# Altium project DE-180417.PrjPcb
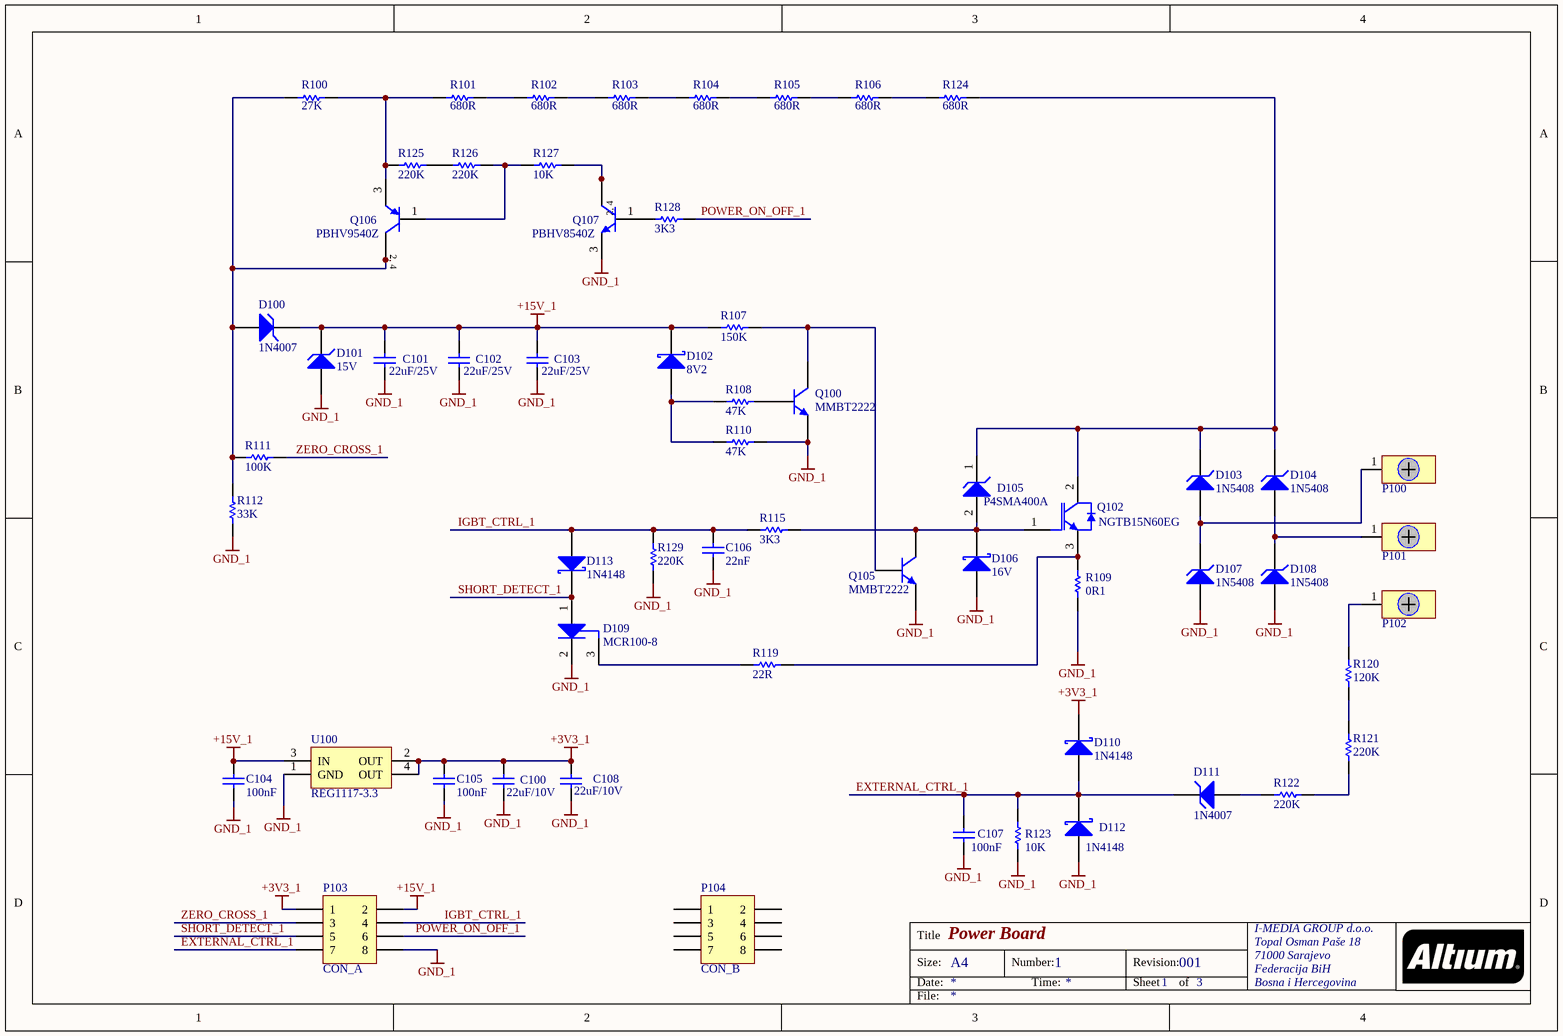
[diagram p0: DE-180417_01.SchDoc]
3 sheets, 113 parts. Net scope: global (net labels, ports and power ports of the same name join across sheets).
Board file: DE-180417.PcbDoc
Sheets:
  DE-180417_01.SchDoc
  DE-180417_02.SchDoc
  DE-180417_03.SchDoc

## Sheet DE-180417_01.SchDoc: Power Board
size A4; Author: eldar6776@hotmail.com; DrawnBy: Eldar Dedić; Organization: I-MEDIA GROUP d.o.o.; Address1: Topal Osman Paše 18; Address2: 71000 Sarajevo; Address3: Federacija BiH; Address4: Bosna i Hercegovina; DocumentNumber: 1; Revision: 001; SheetNumber: 1; SheetTotal: 3; ProjectName: Prekidač rasvjete balkona

### Parts
C100  22uF/10V  [1210]
C101  22uF/25V  [1210]
C102  22uF/25V  [1210]
C103  22uF/25V  [1210]
C104  100nF  [0603]
C105  100nF  [0603]
C106  22nF  [0603]
C107  100nF  [0603]
C108  22uF/10V  [1210]
D100  1N4007  [DO214]
D101  15V  [DO214]
D102  8V2  [SOD323]
D103  1N5408  [DO214]
D104  1N5408  [DO214]
D105  P4SMA400A  [ONSC-SMC-2-403-03_V]
D106  16V  [SOD323]
D107  1N5408  [DO214]
D108  1N5408  [DO214]
D109  MCR100-8  [INF-SOT89_N]
D110  1N4148  [SOD323]
D111  1N4007  [DO214]
D112  1N4148  [SOD323]
D113  1N4148  [SOD323]
P100  Single Wire Lug  [Single Wire Lug]  (value not drawn)
P101  Single Wire Lug  [Single Wire Lug]  (value not drawn)
P102  Single Wire Lug  [Single Wire Lug]  (value not drawn)
P103  CON_A  [HDR2X4]
P104  CON_B  [HDR2X4]
Q100  MMBT2222  [SOT23_N]
Q102  NGTB15N60EG  [ONSC-TO-220-3-221A-09]
Q105  MMBT2222  [SOT23_N]
Q106  PBHV9540Z  [SOT223_N]
Q107  PBHV8540Z  [SOT223_N]
R100  27K  [12-1812]
R101  680R  [12-1812]
R102  680R  [12-1812]
R103  680R  [12-1812]
R104  680R  [12-1812]
R105  680R  [12-1812]
R106  680R  [12-1812]
R107  150K  [ERA-0603]
R108  47K  [ERA-0603]
R109  0R1  [14-1210]
R110  47K  [ERA-0603]
R111  100K  [ERA-0603]
R112  33K  [ERA-0805]
R115  3K3  [ERA-0603]
R119  22R  [ERA-0603]
R120  120K  [ERA-0805]
R121  220K  [ERA-0805]
R122  220K  [ERA-0805]
R123  10K  [ERA-0603]
R124  680R  [12-1812]
R125  220K  [ERA-0805]
R126  220K  [ERA-0805]
R127  10K  [ERA-0805]
R128  3K3  [ERA-0805]
R129  220K  [ERA-0603]
U100  REG1117-3.3  [ZZ311]

### Nets
+3V3_1: C100.2 C105.2 C108.2 D110.1(K) P103.1 U100.2(OUT) U100.4(OUT)
+15V_1: C101.2 C102.2 C103.2 C104.2 D100.2(K) D101.2(K) D102.1(K) P103.2 R107.1 U100.3(IN)
GND_1: C100.1 C101.1 C102.1 C103.1 C104.1 C105.1 C106.1 C107.1 C108.1 D101.1(A) D106.2(A) D107.1(A) D108.1(A) D109.2(K) D112.2(A) P103.8 Q100.2(E) Q105.2(E) Q107.3(E) R109.1 R110.2 R112.1 R123.1 R129.1 U100.1(GND)
EXTERNAL_CTRL_1: C107.2 D110.2(A) D111.2(K) D112.1(K) P103.7 R123.2
IGBT_CTRL_1: C106.2 D113.2(A) P103.4 R115.1 R129.2
POWER_ON_OFF_1: P103.6 R128.1
SHORT_DETECT_1: D109.1(A) D113.1(K) P103.5
ZERO_CROSS_1: P103.3 R111.1
NetD100_1: D100.1(A) Q106.2(C) Q106.4(C) R100.1 R111.2 R112.2
NetD102_2: D102.2(A) R108.1 R110.1
NetD103_1: D103.1(A) D107.2(K) P100.1
NetD103_2: D103.2(K) D104.2(K) D105.1(K) Q102.2(C) R124.2
NetD104_1: D104.1(A) D108.2(K) P101.1
NetD105_2: D105.2(A) D106.1(K) Q102.1(G) Q105.3(C) R115.2
NetD109_3: D109.3(G) R119.1
NetD111_1: D111.1(A) R122.2
NetP102_1: P102.1 R120.1
NetQ100_1: Q100.1(B) R108.2
NetQ100_3: Q100.3(C) Q105.1(B) R107.2
NetQ102_3: Q102.3(E) R109.2 R119.2
NetQ106_1: Q106.1(B) R126.1 R127.2
NetQ106_3: Q106.3(E) R100.2 R101.1 R125.1
NetQ107_1: Q107.1(B) R128.2
NetQ107_2: Q107.2(C) Q107.4(C) R127.1
NetR101_2: R101.2 R102.1
NetR102_2: R102.2 R103.1
NetR103_2: R103.2 R104.1
NetR104_2: R104.2 R105.1
NetR105_2: R105.2 R106.1
NetR106_2: R106.2 R124.1
NetR120_2: R120.2 R121.1
NetR121_2: R121.2 R122.1
NetR125_2: R125.2 R126.2

Not connected (* = marked no-connect by the designer): P104 1 2 3 4 5 6 7 8

### Notes on the sheet
- Title
- Size:
- Date:
- A4
- Number:
- Time:
- Revision:
- Sheet
- of
- File:
- (in symbol BCP51) 2, 4
- (in symbol BCP54) 2, 4

### Library data of the parts
C100-C103 C108 = C1210: Ceramic Chip Capacitor - Standard; Published: 17-Jul-2002; LatestRevisionDate: 19-Mar-2004; LatestRevisionNote: Silkscreen size reduced.; DatasheetDocument: Mar-2001; PackageDocument: Mar-2001; PackageReference: 1210; Publisher: Altium Limited; Code_JEITA: 1210; Code_IPC: 3225 [1210]; ComponentLink1Description: Manufacturer Link; ComponentLink1URL: http://www.kemet.com/; ComponentLink2Description: Datasheet; ComponentLink2URL: http://www.kemet.com/kemet/web/homepage/kechome.nsf/vapubfilesname/F3102TA.pdf/$file/F3102TA.pdf
  C100 C108: Value: 22uF/10V
  C101-C103: Value: 22uF/25V
C104-C107 = C0603: Ceramic Chip Capacitor - Standard; Note: Footprint corresponds to dimensions for bulk cassette packaging. This case size has tightened tolerances.; Published: 17-Jul-2002; LatestRevisionDate: 19-Mar-2004; LatestRevisionNote: Silkscreen size reduced.; DatasheetDocument: Mar-2001; PackageDocument: Mar-2001; PackageReference: 0603; Publisher: Altium Limited; Code_JEITA: 0603; Code_IPC: 1608 [0603]; ComponentLink1Description: Manufacturer Link; ComponentLink1URL: http://www.kemet.com/; ComponentLink2Description: Datasheet; ComponentLink2URL: http://www.kemet.com/kemet/web/homepage/kechome.nsf/vapubfilesname/F3102TA.pdf/$file/F3102TA.pdf
D100 D111 = BZG03C10: Silicon Zener Diode (3W); Published: 8-Jun-2000; LatestRevisionDate: 17-Jul-2002; LatestRevisionNote: Re-released for DXP Platform.; DatasheetDocument: 1-Apr-1999; PackageDocument: Apr-1999; PackageReference: DO214; Publisher: Altium Limited; ComponentLink1Description: Manufacturer Link; ComponentLink1URL: http://www.vishay.com/; ComponentLink2Description: Datasheet; ComponentLink2URL: http://www.vishay.com/docs/85593/85593.pdf
D101 D103 D104 D107 D108 = BZG05C15: Silicon Zener Diode (3W); Published: 8-Jun-2000; LatestRevisionDate: 17-Jul-2002; LatestRevisionNote: Re-released for DXP Platform.; DatasheetDocument: 1-Apr-1999; PackageDocument: Apr-1999; PackageReference: DO214; Publisher: Altium Limited; ComponentLink1Description: Manufacturer Link; ComponentLink1URL: http://www.vishay.com/; ComponentLink2Description: Datasheet; ComponentLink2URL: http://www.vishay.com/docs/85595/85595.pdf
  D101: Value: 15V
  D103 D104 D107 D108: Value: 1N5408
D102 D106 D110 D112 D113 = 1PS76SB10: Schottky Barrier Diode; Published: 17-Sep-2003; LatestRevisionDate: 19-Mar-2004; LatestRevisionNote: Silkscreen size reduced.; DatasheetVersion: 14-Oct-1996; PackageVersion: May-1999; PackageReference: SOD323; Publisher: Altium Limited; PackageDescription: SOD-323/SC-76; 2 Leads; Body 1.7 x 1.3 mm, (LxW); ComponentLink1Description: Manufacturer Link; ComponentLink1URL: http://www.semiconductors.philips.com/; ComponentLink2Description: Datasheet; ComponentLink2URL: http://www.semiconductors.philips.com/acrobat/datasheets/1PS76SB10_2.pdf
D105 = 1SMC9.0AT3G: 1500 W Peak Power Zener Transient Voltage Suppressor, Unidirectional, 2-Pin SMC, Pb-Free, Tape and Reel; Manufacturer: On Semiconductor; IR Max (uA): 10; PPK Max (W): 1500; V(BR) Typ (V): 10.55; DatasheetVersion: Rev. 8; PackageVersion: Rev. E, 08/2005; PackageReference: SMC-2-403-03; PackageDescription: 2-Pin Small Molded Package, J-Bend Lead, Body 5.845 x 6.855 mm; Supplier 1: Digi-Key; Supplier Part Number 1: 1SMC9.0AT3G-ND; Supplier 2: Mouser; Supplier Part Number 2: 863-1SMC9.0AT3G; Direction: Unidirectional; Packing: Tape and Reel; RoHS: Pb-Free; Mounting Technology: Surface Mount; PartNumber: 1SMC9.0AT3G; ComponentLink1Description: Manufacturer URL; ComponentLink1URL: http://www.onsemi.com/; ComponentLink2Description: Datasheet; ComponentLink2URL: http://www.onsemi.com/pub_link/Collateral/1SMC5.0AT3-D.PDF; ComponentLink3Description: Package Specification; ComponentLink3URL: http://www.onsemi.com/pub_link/Collateral/403-03.PDF
D109 = BAW78D: Silicon Switching Diode, SOT89, Reel, Green; Manufacturer: Infineon; Green: TRUE; PackageReference: SOT89; PackageDescription: 3-Pin Small Outline Transistor Package, 2.5 x 4.5 mm Body; Supplier 1: Mouser; Supplier Part Number 1: N/A; Packing: Reel; Mounting Technology: Surface Mount; PartNumber: BAW78D; ComponentLink1Description: Manufacturer URL; ComponentLink1URL: http://www.infineon.com/; ComponentLink2Description: Datasheet; ComponentLink2URL: http://www.infineon.com/dgdl/baw78_baw79series.pdf?folderId=db3a30431400ef6801141c4ed9df0449&fileId=db3a30431400ef6801141c5037ac044a; ComponentLink3Description: Package Specification; ComponentLink3URL: http://www.infineon.com/dgdl/SOT89-Package_Overview.pdf?folderId=db3a30431936bc4b01195371b8363cff&fileId=db3a30431936bc4b0119537ed61d3d22
P100-P102 = Wire Lug
P103 P104 = Header 4X2: Header, 4-Pin, Dual row; LatestRevisionDate: 17-Jul-2002; LatestRevisionNote: Re-released for DXP Platform.; Publisher: Altium Limited
Q100 Q105 = BC817: NPN General-purpose Transistor; Published: 17-Sep-2003; LatestRevisionDate: 12-Dec-2006; LatestRevisionNote: IPC-7351 Footprint Added.; DatasheetVersion: Jun-1999; PackageVersion: May-1999; PackageReference: SOT23; Publisher: Altium Limited; PackageDescription: 3-Pin SOT-23 Package 0.95 mm Pitch, 2.3 mm Lead Span; ComponentLink1Description: Manufacturer Link; ComponentLink1URL: http://www.semiconductors.philips.com/; ComponentLink2Description: Datasheet; ComponentLink2URL: http://www.semiconductors.philips.com/acrobat/datasheets/BC817_BC817W_BC337_5.pdf
Q102 = NGTB15N60EG: IGBT - Short-Circuit Rated, 3-Pin TO-220, Pb-Free, Tube; Manufacturer: On Semiconductor; DatasheetVersion: Rev. 7; PackageVersion: Rev. AG, 09/2011; PackageReference: TO-220-3-221A-09; PackageDescription: 3-Pin Flange Mount, Vertical Straight Lead, Body 9.97 x 4.445 mm, Pitch 2.54 mm; Supplier 1: Digi-Key; Supplier Part Number 1: NGTB15N60EGOS-ND; Supplier 2: Farnell; Supplier Part Number 2: 2216666; Supplier 3: Newark; Supplier Part Number 3: 07W7304; Supplier 4: Newark; Supplier Part Number 4: 46W5231; Supplier 5: Mouser; Supplier Part Number 5: 863-NGTB15N60EG; Packing: Tube; RoHS: Pb-Free; Mounting Technology: Through Hole; PartNumber: NGTB15N60EG; ComponentLink1Description: Manufacturer URL; ComponentLink1URL: http://www.onsemi.com/; ComponentLink2Description: Datasheet; ComponentLink2URL: http://www.onsemi.com/pub_link/Collateral/NGTB15N60E-D.PDF; ComponentLink3Description: Package Specification; ComponentLink3URL: http://www.onsemi.com/pub_link/Collateral/221A-09.PDF
Q106 = BCP51: PNP Medium Power Transistor; Published: 17-Sep-2003; LatestRevisionDate: 12-Dec-2006; LatestRevisionNote: IPC-7351 Footprint Added.; DatasheetVersion: 10-Oct-2001; PackageVersion: Aug-2001; PackageReference: SOT223; Publisher: Altium Limited; PackageDescription: 4-Pin SOT-223 Package 2.3 mm Pitch, 7 mm Lead Span; ComponentLink1Description: Manufacturer Link; ComponentLink1URL: http://www.semiconductors.philips.com/; ComponentLink2Description: Datasheet; ComponentLink2URL: http://www.semiconductors.philips.com/acrobat/datasheets/BCP51_52_53_5.pdf
Q107 = BCP54: NPN Medium Power Transistor; Published: 17-Sep-2003; LatestRevisionDate: 12-Dec-2006; LatestRevisionNote: IPC-7351 Footprint Added.; DatasheetVersion: 10-Oct-2001; PackageVersion: Aug-2001; PackageReference: SOT223; Publisher: Altium Limited; PackageDescription: 4-Pin SOT-223 Package 2.3 mm Pitch, 7 mm Lead Span; ComponentLink1Description: Manufacturer Link; ComponentLink1URL: http://www.semiconductors.philips.com/; ComponentLink2Description: Datasheet; ComponentLink2URL: http://www.semiconductors.philips.com/acrobat/datasheets/BC635_BCP54_BCX54_6.pdf
R100-R106 R124 = ERJ12: Thick Film Chip Resistor, 1 Ohm to 10M Ohm Range, 5% Tolerance, 1812 Size, 0.5 W; Note: If flow soldering, adjust pad width of PCB Footprint to 0.7 - 0.8 times the width of the resistor.; Published: 17-Dec-2003; LatestRevisionDate: 19-Mar-2004; LatestRevisionNote: Silkscreen size reduced.; PackageDocument: Mar-2003; PackageReference: 12-1812; Publisher: Altium Limited; ComponentLink1Description: Manufacturer Link; ComponentLink1URL: http://www.panasonic.com/industrial/components/resistive_products.htm; ComponentLink2Description: Datasheet; ComponentLink2URL: http://www.panasonic.com/industrial/components/pdf/AOA0000CE1.pdf
  R100: Value: 27K
  R101-R106 R124: Value: 680R
R107 R108 R110 R111 R115 R119 R123 R129 = ERAV: Metal Film Thermosensitive Chip Resistor, 0.56 Ohm to 10k Ohm Range, 5% Tolerance, 0603 Size, 0.063 W; Note: If flow soldering, adjust pad width of PCB Footprint to 0.7 - 0.8 times the width of the resistor.; Published: 17-Dec-2003; LatestRevisionDate: 19-Mar-2004; LatestRevisionNote: Silkscreen size reduced.; PackageDocument: Mar-2003; PackageReference: ERA-0603; Publisher: Altium Limited; Code_IPC: 1608 [0603]; ComponentLink1Description: Manufacturer Link; ComponentLink1URL: http://www.panasonic.com/industrial/components/resistive_products.htm; ComponentLink2Description: Datasheet; ComponentLink2URL: http://www.panasonic.com/industrial/components/pdf/AOF0000CE1.pdf
R109 = ERJ14: Thick Film Chip Resistor, 1 Ohm to 10M Ohm Range, 5% Tolerance, 1210 Size, 0.25 W; Note: If flow soldering, adjust pad width of PCB Footprint to 0.7 - 0.8 times the width of the resistor.; Published: 17-Dec-2003; LatestRevisionDate: 19-Mar-2004; LatestRevisionNote: Silkscreen size reduced.; PackageDocument: Mar-2003; PackageReference: 14-1210; Publisher: Altium Limited; Code_IPC: 3225 [1210]; ComponentLink1Description: Manufacturer Link; ComponentLink1URL: http://www.panasonic.com/industrial/components/resistive_products.htm; ComponentLink2Description: Datasheet; ComponentLink2URL: http://www.panasonic.com/industrial/components/pdf/AOA0000CE1.pdf; Value: 0R1
R112 R120-R122 R125-R128 = ERA6Y: Rectangular Thick Film Chip Resistor, 10 Ohm to 1M Ohm Range, 0.1% and 0.5% Tolerance, 0805 Size, 0.1 W; Note: If flow soldering, adjust pad width of PCB Footprint to 0.7 - 0.8 times the width of the resistor.; Published: 17-Dec-2003; LatestRevisionDate: 19-Mar-2004; LatestRevisionNote: Silkscreen size reduced.; PackageDocument: Mar-2003; PackageReference: ERA-0805; Publisher: Altium Limited; Code_IPC: 2012 [0805]; ComponentLink1Description: Manufacturer Link; ComponentLink1URL: http://www.panasonic.com/industrial/components/resistive_products.htm; ComponentLink2Description: Datasheet; ComponentLink2URL: http://www.panasonic.com/industrial/components/pdf/AOA0000CE8.pdf
  R112: Value: 33K
  R120: Value: 120K
  R121 R122: Value: 220K
U100 = REG1117-3.3: 800mA and 1A Low Dropout Positive Regulator 2.85V, 3.3V, 5V, and Adjustable; Published: 8-Jun-2000; LatestRevisionDate: 17-Jul-2002; LatestRevisionNote: Re-released for DXP Platform.; DatasheetVersion: Sep-1997; PackageVersion: revC; PackageReference: ZZ311; Publisher: Altium Limited; PackageDescription: SOT-223/SC-73; 4 Leads; Body 6.7 x 7.3 mm, inc. leads (LxW max); ComponentLink1Description: Manufacturer Link; ComponentLink1URL: http://www.ti.com/; ComponentLink2Description: Datasheet; ComponentLink2URL: http://www-s.ti.com/sc/ds/REG1117.pdf

## Sheet DE-180417_02.SchDoc: Microcontroller & Com Board
size A4; Author: eldar6776@hotmail.com; DrawnBy: Eldar Dedić; Organization: I-MEDIA GROUP d.o.o.; Address1: Topal Osman Paše 18; Address2: 71000 Sarajevo; Address3: Federacija BiH; Address4: Bosna i Hercegovina; DocumentNumber: 2; Revision: 001; SheetNumber: 2; SheetTotal: 3; ProjectName: Prekidač Balkonske Rasvjete
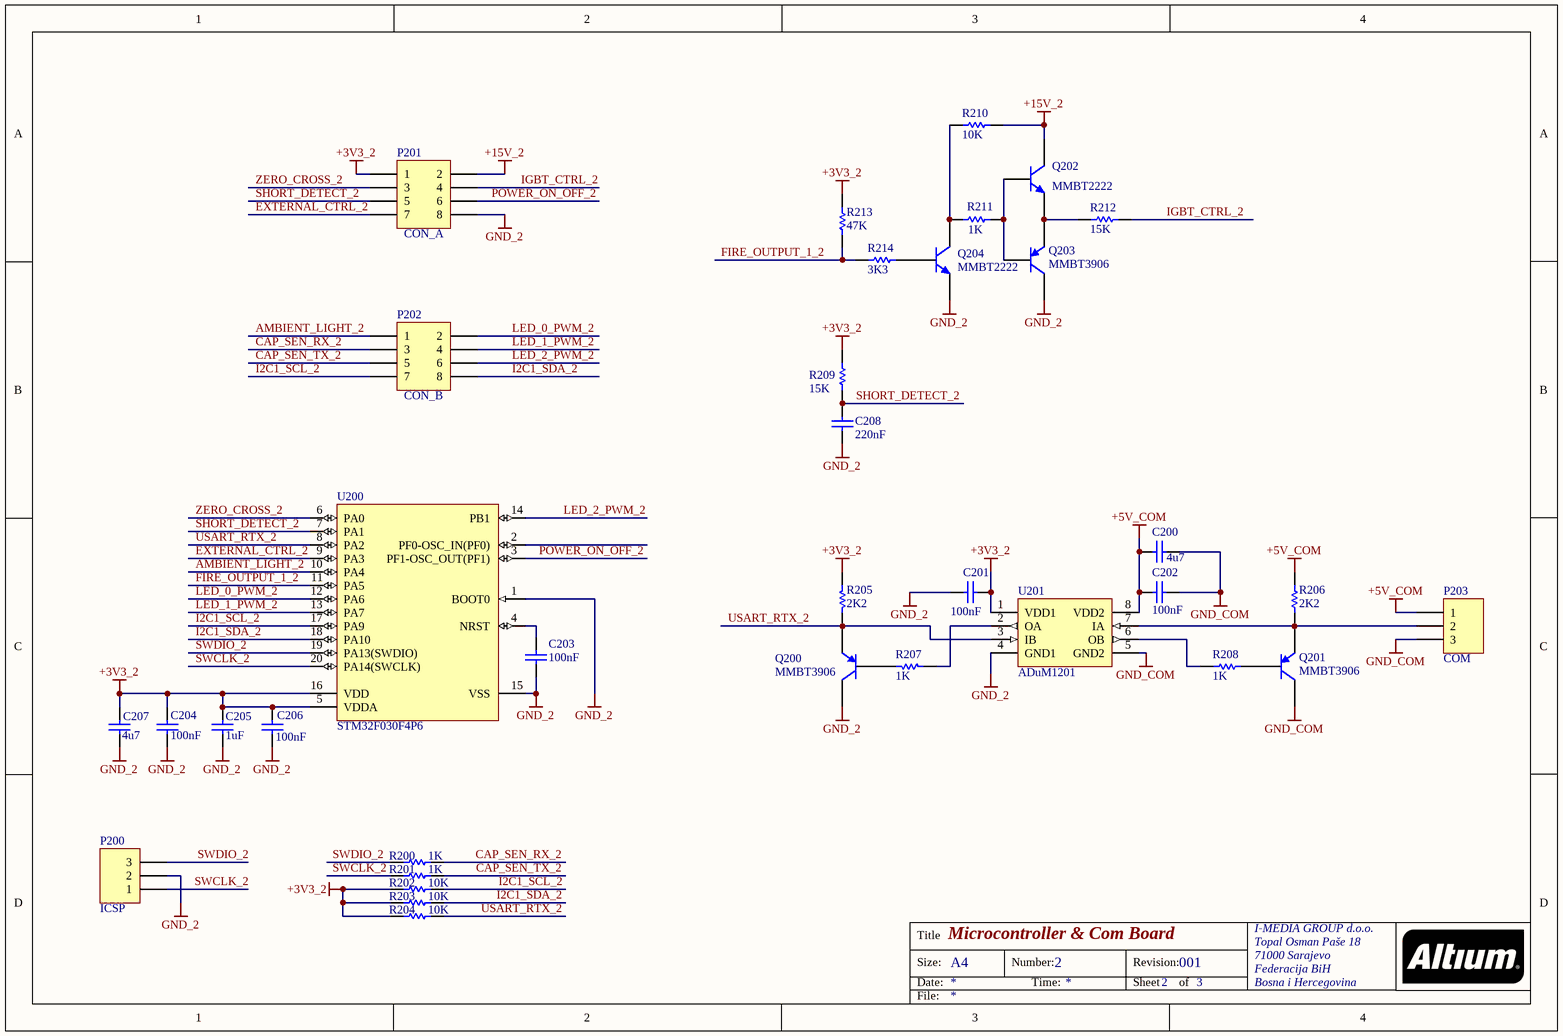
[diagram p1: DE-180417_02.SchDoc]

### Parts
C200  4u7  [0805]
C201  100nF  [0603]
C202  100nF  [0603]
C203  100nF  [0603]
C204  100nF  [0603]
C205  1uF  [0603]
C206  100nF  [0603]
C207  4u7  [0805]
C208  220nF  [0603]
P200  ICSP  [HDR1X3]
P201  CON_A  [HDR2X4]
P202  CON_B  [HDR2X4]
P203  COM  [HDR1X3]
Q200  MMBT3906  [SOT23_N]
Q201  MMBT3906  [SOT23_N]
Q202  MMBT2222  [SOT23_N]
Q203  MMBT3906  [SOT23_N]
Q204  MMBT2222  [SOT23_N]
R200  1K  [ERA-0603]
R201  1K  [ERA-0603]
R202  10K  [ERA-0603]
R203  10K  [ERA-0603]
R204  10K  [ERA-0603]
R205  2K2  [ERA-0603]
R206  2K2  [ERA-0603]
R207  1K  [ERA-0603]
R208  1K  [ERA-0603]
R209  15K  [ERA-0603]
R210  10K  [ERA-0603]
R211  1K  [ERA-0603]
R212  15K  [ERA-0603]
R213  47K  [ERA-0603]
R214  3K3  [ERA-0603]
U200  STM32F030F4P6  [STM-TSSOP20_N]
U201  ADuM1201  [SOP8]

### Nets
+3V3_2: C201.1 C204.1 C205.1 C206.1 C207.1 P201.1 R202.2 R203.2 R204.2 R205.1 R209.2 R213.1 U200.5(VDDA) U200.16(VDD) U201.1(VDD1)
+5V_COM: C200.1 C202.1 P203.1 R206.1 U201.8(VDD2)
+15V_2: P201.2 Q202.3(C) R210.1
GND_2: C201.2 C203.2 C204.2 C205.2 C206.2 C207.2 C208.1 P200.2 P201.8 Q200.3(C) Q203.3(C) Q204.2(E) U200.1(BOOT0) U200.15(VSS) U201.4(GND1)
GND_COM: C200.2 C202.2 P203.3 Q201.3(C) U201.5(GND2)
AMBIENT_LIGHT_2: P202.1 U200.10(PA4)
CAP_SEN_RX_2: P202.3 R200.1
CAP_SEN_TX_2: P202.5 R201.1
EXTERNAL_CTRL_2: P201.7 U200.9(PA3)
FIRE_OUTPUT_1_2: R213.2 R214.2 U200.11(PA5)
I2C1_SCL_2: P202.7 R202.1 U200.17(PA9)
I2C1_SDA_2: P202.8 R203.1 U200.18(PA10)
IGBT_CTRL_2: P201.4 R212.2
LED_0_PWM_2: P202.2 U200.12(PA6)
LED_1_PWM_2: P202.4 U200.13(PA7)
LED_2_PWM_2: P202.6 U200.14(PB1)
POWER_ON_OFF_2: P201.6 U200.3(PF1-OSC_OUT(PF1))
SHORT_DETECT_2: C208.2 P201.5 R209.1 U200.7(PA1)
SWCLK_2: P200.1 R201.2 U200.20(PA14(SWCLK))
SWDIO_2: P200.3 R200.2 U200.19(PA13(SWDIO))
USART_RTX_2: Q200.2(E) R204.1 R205.2 U200.8(PA2) U201.3(IB)
ZERO_CROSS_2: P201.3 U200.6(PA0)
NetC203_1: C203.1 U200.4(NRST)
NetP203_2: P203.2 Q201.2(E) R206.2 U201.7(IA)
NetQ200_1: Q200.1(B) R207.1
NetQ201_1: Q201.1(B) R208.1
NetQ202_1: Q202.1(B) Q203.1(B) R211.1
NetQ202_2: Q202.2(E) Q203.2(E) R212.1
NetQ204_1: Q204.1(B) R214.1
NetQ204_3: Q204.3(C) R210.2 R211.2
NetR207_2: R207.2 U201.2(OA)
NetR208_2: R208.2 U201.6(OB)

Not connected (* = marked no-connect by the designer): U200 2(PF0-OSC_IN(PF0))

### Notes on the sheet
- Title
- Size:
- Date:
- A4
- Number:
- Time:
- Revision:
- Sheet
- of
- File:

### Library data of the parts
C200 C207 = C0805: Ceramic Chip Capacitor - Standard; Note: Footprint corresponds to dimensions for bulk cassette packaging. This case size has tightened tolerances.; Published: 17-Jul-2002; LatestRevisionDate: 19-Mar-2004; LatestRevisionNote: Silkscreen size reduced.; DatasheetDocument: Mar-2001; PackageDocument: Mar-2001; PackageReference: 0805; Publisher: Altium Limited; Code_JEITA: 0805; Code_IPC: 2012[0805]; ComponentLink1Description: Manufacturer Link; ComponentLink1URL: http://www.kemet.com/; ComponentLink2Description: Datasheet; ComponentLink2URL: http://www.kemet.com/kemet/web/homepage/kechome.nsf/vapubfilesname/F3102TA.pdf/$file/F3102TA.pdf; Value: 4u7
C201-C205 C208 = C0603: as C104 on sheet DE-180417_01; Published: 17-Jul-2002; LatestRevisionDate: 19-Mar-2004; LatestRevisionNote: Silkscreen size reduced.; DatasheetDocument: Mar-2001; PackageDocument: Mar-2001; PackageReference: 0603; Publisher: Altium Limited; Code_JEITA: 0603; Code_IPC: 1608 [0603]; ComponentLink1Description: Manufacturer Link; ComponentLink1URL: http://www.kemet.com/; ComponentLink2Description: Datasheet; ComponentLink2URL: http://www.kemet.com/kemet/web/homepage/kechome.nsf/vapubfilesname/F3102TA.pdf/$file/F3102TA.pdf
  C203 C204: Value: 100nF
  C205: Value: 1uF
C206 = C0603: Ceramic Chip Capacitor - Standard; Note: Footprint corresponds to dimensions for bulk cassette packaging. This case size has tightened tolerances.; Value: 10nF; Published: 17-Jul-2002; LatestRevisionDate: 19-Mar-2004; LatestRevisionNote: Silkscreen size reduced.; DatasheetDocument: Mar-2001; PackageDocument: Mar-2001; PackageReference: 0603; Publisher: Altium Limited; Code_JEITA: 0603; Code_IPC: 1608 [0603]; ComponentLink1Description: Manufacturer Link; ComponentLink1URL: http://www.kemet.com/; ComponentLink2Description: Datasheet; ComponentLink2URL: http://www.kemet.com/kemet/web/homepage/kechome.nsf/vapubfilesname/F3102TA.pdf/$file/F3102TA.pdf
P200 P203 = Header 3: Header, 3-Pin; LatestRevisionDate: 17-Jul-2002; LatestRevisionNote: Re-released for DXP Platform.; Publisher: Altium Limited
P201 P202 = Header 4X2: Header, 4-Pin, Dual row; LatestRevisionDate: 17-Jul-2002; LatestRevisionNote: Re-released for DXP Platform.; Publisher: Altium Limited
Q200 Q201 Q203 = BC807: PNP General-purpose Transistor; Published: 17-Sep-2003; LatestRevisionDate: 12-Dec-2006; LatestRevisionNote: IPC-7351 Footprint Added.; DatasheetVersion: 8-Apr-1999; PackageVersion: May-1999; PackageReference: SOT23; Publisher: Altium Limited; PackageDescription: 3-Pin SOT-23 Package 0.95 mm Pitch, 2.3 mm Lead Span; ComponentLink1Description: Manufacturer Link; ComponentLink1URL: http://www.semiconductors.philips.com/; ComponentLink2Description: Datasheet; ComponentLink2URL: http://www.semiconductors.philips.com/acrobat/datasheets/BC807_BC807W_BC327_5.pdf
Q202 Q204 = BC817: NPN General-purpose Transistor; Published: 17-Sep-2003; LatestRevisionDate: 12-Dec-2006; LatestRevisionNote: IPC-7351 Footprint Added.; DatasheetVersion: Jun-1999; PackageVersion: May-1999; PackageReference: SOT23; Publisher: Altium Limited; PackageDescription: 3-Pin SOT-23 Package 0.95 mm Pitch, 2.3 mm Lead Span; ComponentLink1Description: Manufacturer Link; ComponentLink1URL: http://www.semiconductors.philips.com/; ComponentLink2Description: Datasheet; ComponentLink2URL: http://www.semiconductors.philips.com/acrobat/datasheets/BC817_BC817W_BC337_5.pdf
R200-R214 = ERAV: as R107 on sheet DE-180417_01; Published: 17-Dec-2003; LatestRevisionDate: 19-Mar-2004; LatestRevisionNote: Silkscreen size reduced.; PackageDocument: Mar-2003; PackageReference: ERA-0603; Publisher: Altium Limited; Code_IPC: 1608 [0603]; ComponentLink1Description: Manufacturer Link; ComponentLink1URL: http://www.panasonic.com/industrial/components/resistive_products.htm; ComponentLink2Description: Datasheet; ComponentLink2URL: http://www.panasonic.com/industrial/components/pdf/AOF0000CE1.pdf
U200 = STM32F030F4P6: ARM Cortex-M0 32-bit MCU, 16 KB Flash, 4 KB Internal RAM, 15 I/Os, 20-pin TSSOP, -40 to 85 degC, Tube; FLASH Size (Prog) (kB): 16; I/Os (High Current): 15; Internal RAM Size (kB): 4; Operating Frequency(F) (Processor speed) (MHz): 48; Supply Voltage(Vcc) min (V): 2.4; DatasheetVersion: Rev. 1; PackageVersion: Rev. 1, 11/2012; PackageReference: TSSOP20; PackageDescription: 20-Pin Thin Shrink Small Outline Package, 6.5 x 4.4 mm Body, 0.65 mm Pitch; Supplier 1: Digi-Key; Supplier Part Number 1: 497-14044-5-ND; Supplier 2: Newark; Supplier Part Number 2: 06X3648; Supplier 3: Mouser; Supplier Part Number 3: 511-STM32F030F4P6; Core: ARM Cortex-M0; Packing: Tube; Mounting Technology: Surface Mount; PartNumber: STM32F030F4P6; ComponentLink1Description: Manufacturer URL; ComponentLink1URL: http://www.st.com/web/en/home.html; ComponentLink2Description: Datasheet; ComponentLink2URL: http://www.st.com/st-web-ui/static/active/en/resource/technical/document/datasheet/DM00088500.pdf; ComponentLink3Description: Package Specification; ComponentLink3URL: http://www.st.com/st-web-ui/static/active/en/resource/technical/document/datasheet/DM00065136.pdf
U201 = ADuM1201: Digital Isolator

## Sheet DE-180417_03.SchDoc: Sensor Board
size A4; Author: eldar6776@hotmail.com; DrawnBy: Eldar DEdić; Organization: I-MEDIA GROUP d.o.o.; Address1: Topal Osman Paše 18; Address2: 71000 Sarajevo; Address3: Federacija BiH; Address4: Bosna i Hercegovina; DocumentNumber: 3; Revision: 001; SheetNumber: 3; SheetTotal: 3; ProjectName: Prekidač Balkonske Rasvjete
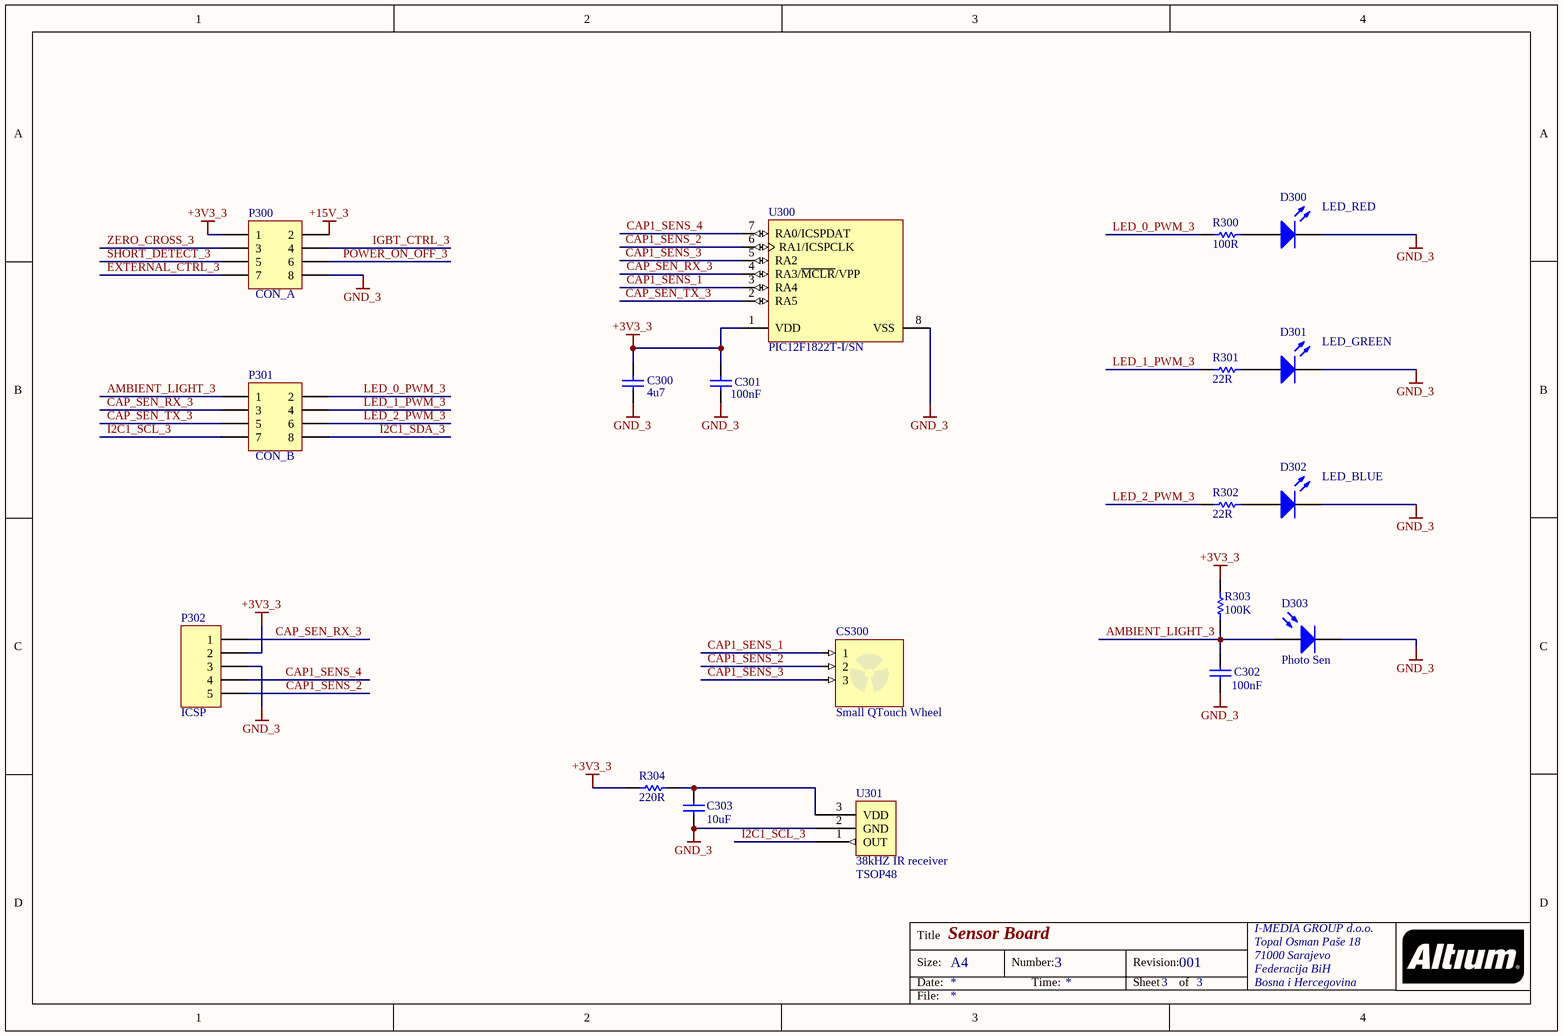
[diagram p2: DE-180417_03.SchDoc]

### Parts
C300  4u7  [0805]
C301  100nF  [0603]
C302  100nF  [0603]
C303  10uF  [0805]
CS300  Small QTouch Wheel  (no BOM)
D300  LED_RED  [1.6X0.8X0.8]
D301  LED_GREEN  [1.6X0.8X0.8]
D302  LED_BLUE  [1.6X0.8X0.8]
D303  Photo Sen  [PIN2]
P300  CON_A  [HDR2X4]
P301  CON_B  [HDR2X4]
P302  ICSP  [HDR1X5]
R300  100R  [ERA-0603]
R301  22R  [ERA-0603]
R302  22R  [ERA-0603]
R303  100K  [ERA-0603]
R304  220R  [ERA-0603]
U300  PIC12F1822T-I/SN  [MCHP-SOIC-SN8_N]
U301  38kHZ IR receiver  value TSOP48  [TSOP48]

### Nets
+3V3_3: C300.1 C301.1 P300.1 P302.2 R303.1 R304.1 U300.1(VDD)
+15V_3: P300.2
GND_3: C300.2 C301.2 C302.2 C303.2 D300.2(K) D301.2(K) D302.2(K) D303.2(K) P300.8 P302.3 U300.8(VSS) U301.2(GND)
AMBIENT_LIGHT_3: C302.1 D303.1(A) P301.1 R303.2
CAP1_SENS_1: CS300.1 U300.3(RA4)
CAP1_SENS_2: CS300.2 P302.5 U300.6(RA1/ICSPCLK)
CAP1_SENS_3: CS300.3 U300.5(RA2)
CAP1_SENS_4: P302.4 U300.7(RA0/ICSPDAT)
CAP_SEN_RX_3: P301.3 P302.1 U300.4(RA3/~{MCLR}/VPP)
CAP_SEN_TX_3: P301.5 U300.2(RA5)
EXTERNAL_CTRL_3: P300.7
I2C1_SCL_3: P301.7 U301.1(OUT)
I2C1_SDA_3: P301.8
IGBT_CTRL_3: P300.4
LED_0_PWM_3: P301.2 R300.2
LED_1_PWM_3: P301.4 R301.2
LED_2_PWM_3: P301.6 R302.2
POWER_ON_OFF_3: P300.6
SHORT_DETECT_3: P300.5
ZERO_CROSS_3: P300.3
NetC303_1: C303.1 R304.2 U301.3(VDD)
NetD300_1: D300.1(A) R300.1
NetD301_1: D301.1(A) R301.1
NetD302_1: D302.1(A) R302.1

### Notes on the sheet
- Title
- Size:
- Date:
- A4
- Number:
- Time:
- Revision:
- Sheet
- of
- File:

### Library data of the parts
C300 C303 = C0805: as C200 on sheet DE-180417_02; Published: 17-Jul-2002; LatestRevisionDate: 19-Mar-2004; LatestRevisionNote: Silkscreen size reduced.; DatasheetDocument: Mar-2001; PackageDocument: Mar-2001; PackageReference: 0805; Publisher: Altium Limited; Code_JEITA: 0805; Code_IPC: 2012[0805]; ComponentLink1Description: Manufacturer Link; ComponentLink1URL: http://www.kemet.com/; ComponentLink2Description: Datasheet; ComponentLink2URL: http://www.kemet.com/kemet/web/homepage/kechome.nsf/vapubfilesname/F3102TA.pdf/$file/F3102TA.pdf
  C300: Value: 4u7
C301 C302 = C0603: as C104 on sheet DE-180417_01; Published: 17-Jul-2002; LatestRevisionDate: 19-Mar-2004; LatestRevisionNote: Silkscreen size reduced.; DatasheetDocument: Mar-2001; PackageDocument: Mar-2001; PackageReference: 0603; Publisher: Altium Limited; Code_JEITA: 0603; Code_IPC: 1608 [0603]; ComponentLink1Description: Manufacturer Link; ComponentLink1URL: http://www.kemet.com/; ComponentLink2Description: Datasheet; ComponentLink2URL: http://www.kemet.com/kemet/web/homepage/kechome.nsf/vapubfilesname/F3102TA.pdf/$file/F3102TA.pdf; Value: 100nF
CS300 = SmallQTouchWheel: ConfiguratorName: ATMEL_TOUCH; ConfigurationParameters: {}__sensorid[7]{}diameter[20]{}
D300-D302 = HSMZ-C190: High Performance Chip LED, Red; LuminousIntensity: 40mcd (Minimum).; PCB_Layout: Complies with manufacturer's recommendation.; Published: 11-Dec-2002; DatasheetDocument: 11-Mar-2002; PackageDocument: 11-Mar-2002; PackageReference: 1.6X0.8X0.8; Publisher: Altium Limited; LED_Colour: Red; ComponentLink1Description: Manufacturer Link; ComponentLink1URL: http://www.agilent.com/; ComponentLink2Description: Datasheet; ComponentLink2URL: http://cp.literature.agilent.com/litweb/pdf/5988-5891EN.pdf
D303 = Photo Sen: Photosensitive Diode; Published: 24-Mar-1999; LatestRevisionDate: 17-Jul-2002; LatestRevisionNote: Re-released for DXP Platform.; PackageReference: PIN2; Publisher: Altium Limited
P300 P301 = Header 4X2: Header, 4-Pin, Dual row; LatestRevisionDate: 17-Jul-2002; LatestRevisionNote: Re-released for DXP Platform.; Publisher: Altium Limited
P302 = Header 5: Header, 5-Pin; LatestRevisionDate: 17-Jul-2002; LatestRevisionNote: Re-released for DXP Platform.; Publisher: Altium Limited
R300-R304 = ERAV: as R107 on sheet DE-180417_01; Published: 17-Dec-2003; LatestRevisionDate: 19-Mar-2004; LatestRevisionNote: Silkscreen size reduced.; PackageDocument: Mar-2003; PackageReference: ERA-0603; Publisher: Altium Limited; Code_IPC: 1608 [0603]; ComponentLink1Description: Manufacturer Link; ComponentLink1URL: http://www.panasonic.com/industrial/components/resistive_products.htm; ComponentLink2Description: Datasheet; ComponentLink2URL: http://www.panasonic.com/industrial/components/pdf/AOF0000CE1.pdf
U300 = PIC12F1822T-I/SN: Flash Microcontroller with XLP Technology, 32 MHz, 5 I/O, -40 to 85 degC, 8-pin SOIC (SN8), Tape and Reel; Manufacturer: Microchip; # of A/D Channels: 4; Digital Communication: 1 -A/E/USART, 1 -MSSP(SPI/I2C); EEPROM Data Memory (bytes): 256; I/O Pins: 5; Internal Oscillator: 32 MHz, 31 kHz; Max. CPU Speed MHz: 32; Operation Voltage Range: 1.8V - 5.5V; Packing: T/R; Program Memory KBytes: 3.5; Program Memory KWords: 2; RAM: 128; Timers: 2 - 8-bit, 1 - 16-bit, 0 - 32-bit; DatasheetVersion: Rev. C; PackageVersion: C04-057C, 12/2012; PackageReference: SOIC-SN8; PackageDescription: 8-Lead Plastic Small Outline, 4.9 x 3.9 mm Body, 1.27 mm Pitch; Supplier 1: Digi-Key; Supplier Part Number 1: PIC12F1822T-I/SN-ND; Supplier 2: Newark; Supplier Part Number 2: 53R0198; Supplier 3: Mouser; Supplier Part Number 3: 579-PIC12F1822T-I/SN; Memory Type: Flash; RoHS: TRUE; Mounting Technology: Surface Mount; PartNumber: PIC12F1822T-I/SN; ComponentLink1Description: Datasheet; ComponentLink1URL: http://ww1.microchip.com/downloads/en/DeviceDoc/41413C.pdf; ComponentLink2Description: Package Specification; ComponentLink2URL: http://www.microchip.com/stellent/groups/techpub_sg/documents/packagingspec/en012702.pdf; ComponentLink3Description: URL Link1; ComponentLink3URL: Product URL:http://www.microchip.com/datasheet/PIC12F1822
U301 = TSOP48